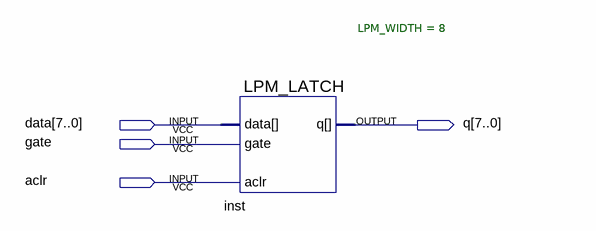
[diagram p0: schematic sheet]
// Quartus schematic lpm_latch0.bdf as structural Verilog: 1 symbols, 4 pins
module lpm_latch0 (
  input  [7:0] data,
  input  gate,
  input  aclr,
  output [7:0] q
);

  LPM_LATCH #(.LPM_WIDTH(8)) inst (.aclr(aclr), .data(data), .gate(gate), .q(q));
endmodule
